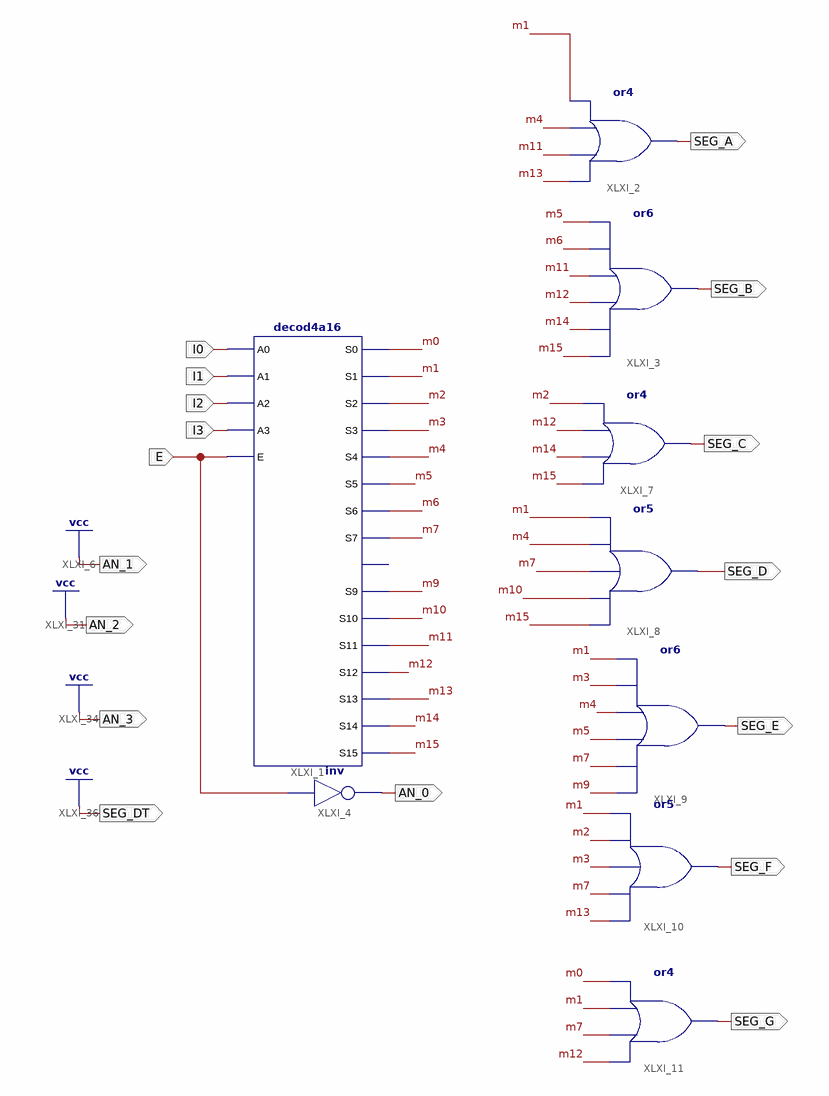
[diagram p0: schematic sheet 1]
// Xilinx ISE schematic hex7seg.sch (spartan3e) as structural Verilog: 9 symbols, 17 ports
module hex7seg (
  input  I2,
  input  I3,
  input  E,
  input  I1,
  input  I0,
  output AN_0,
  output AN_2,
  output AN_3,
  output SEG_DT,
  output SEG_A,
  output SEG_B,
  output SEG_C,
  output SEG_D,
  output SEG_E,
  output SEG_F,
  output SEG_G,
  output AN_1
);

  wire m0, m1, m2, m3, m4, m5, m6, m7, m9, m10, m11, m12, m13, m14, m15;

  decod4a16 XLXI_1 (
    .A0(I0), .A1(I1), .A2(I2), .A3(I3), .E(E), .S0(m0), .S1(m1), .S10(m10), .S11(m11), .S12(m12), .S13(m13),
    .S14(m14), .S15(m15), .S2(m2), .S3(m3), .S4(m4), .S5(m5), .S6(m6), .S7(m7), .S9(m9));  // open: S8
  not XLXI_4 (AN_0, E);
  or XLXI_2 (SEG_A, m13, m11, m4, m1);
  or XLXI_3 (SEG_B, m15, m14, m12, m11, m6, m5);
  or XLXI_7 (SEG_C, m15, m14, m12, m2);
  or XLXI_9 (SEG_E, m9, m7, m5, m4, m3, m1);
  or XLXI_8 (SEG_D, m15, m10, m7, m4, m1);
  or XLXI_10 (SEG_F, m13, m7, m3, m2, m1);
  or XLXI_11 (SEG_G, m12, m7, m1, m0);

  assign AN_1 = 1'b1;
  assign AN_2 = 1'b1;
  assign AN_3 = 1'b1;
  assign SEG_DT = 1'b1;
endmodule
